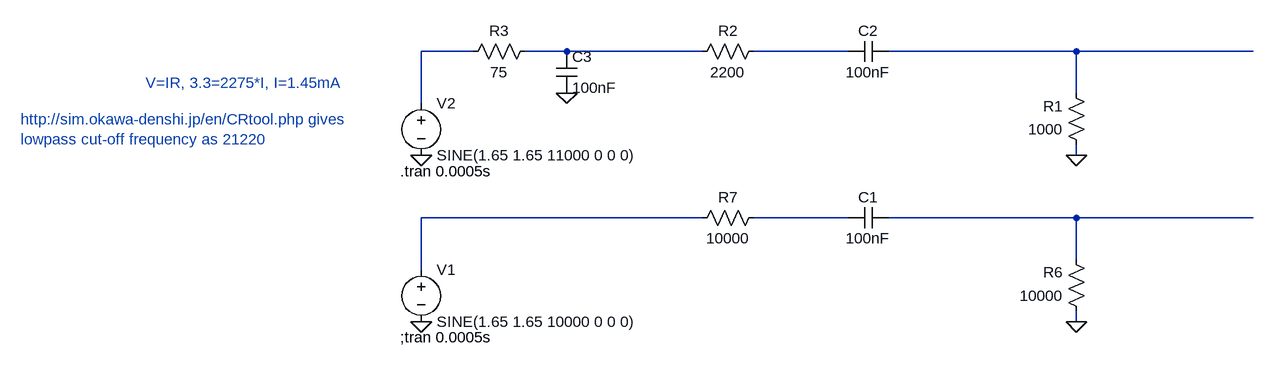
[diagram p0: schematic speaker_volume.asc]
speaker_volume.asc, the LTspice schematic file:
Version 4
SHEET 1 2328 724
WIRE 0 -192 -80 -192
WIRE 144 -192 80 -192
WIRE 352 -192 144 -192
WIRE 576 -192 432 -192
WIRE 928 -192 640 -192
WIRE 1200 -192 928 -192
WIRE 928 -128 928 -192
WIRE -80 -112 -80 -192
WIRE 928 -32 928 -48
WIRE 352 64 -80 64
WIRE 576 64 432 64
WIRE 928 64 640 64
WIRE 1200 64 928 64
WIRE 928 128 928 64
WIRE -80 144 -80 64
WIRE 928 224 928 208
FLAG -80 224 0
FLAG 928 224 0
FLAG -80 -32 0
FLAG 928 -32 0
FLAG 144 -128 0
SYMBOL voltage -80 128 R0
WINDOW 123 0 0 Left 2
WINDOW 39 0 0 Left 2
SYMATTR InstName V1
SYMATTR Value SINE(1.65 1.65 10000 0 0 0)
SYMBOL cap 640 48 R90
WINDOW 0 0 32 VBottom 2
WINDOW 3 32 32 VTop 2
SYMATTR InstName C1
SYMATTR Value 100nF
SYMBOL res 944 224 R180
WINDOW 0 36 76 Left 2
WINDOW 3 36 40 Left 2
SYMATTR InstName R6
SYMATTR Value 10000
SYMBOL res 448 48 R90
WINDOW 0 0 56 VBottom 2
WINDOW 3 32 56 VTop 2
SYMATTR InstName R7
SYMATTR Value 10000
SYMBOL voltage -80 -128 R0
WINDOW 123 0 0 Left 2
WINDOW 39 0 0 Left 2
SYMATTR InstName V2
SYMATTR Value SINE(1.65 1.65 11000 0 0 0)
SYMBOL cap 640 -208 R90
WINDOW 0 0 32 VBottom 2
WINDOW 3 32 32 VTop 2
SYMATTR InstName C2
SYMATTR Value 100nF
SYMBOL res 944 -32 R180
WINDOW 0 36 76 Left 2
WINDOW 3 36 40 Left 2
SYMATTR InstName R1
SYMATTR Value 1000
SYMBOL res 448 -208 R90
WINDOW 0 0 56 VBottom 2
WINDOW 3 32 56 VTop 2
SYMATTR InstName R2
SYMATTR Value 2200
SYMBOL cap 128 -192 R0
SYMATTR InstName C3
SYMATTR Value 100nF
SYMBOL res 96 -208 R90
WINDOW 0 0 56 VBottom 2
WINDOW 3 32 56 VTop 2
SYMATTR InstName R3
SYMATTR Value 75
TEXT -112 248 Left 2 !;tran 0.0005s
TEXT -112 -8 Left 2 !.tran 0.0005s
TEXT -504 -144 Left 2 ;V=IR, 3.3=2275*I, I=1.45mA
TEXT -696 -88 Left 2 ;http://sim.okawa-denshi.jp/en/CRtool.php gives\nlowpass cut-off frequency as 21220

The netlist it stands for:
* speaker_volume.asc
V1 N005 0 SINE(1.65 1.65 10000 0 0 0)
C1 N007 N006 100nF
R6 0 N007 10000
R7 N006 N005 10000
V2 N001 0 SINE(1.65 1.65 11000 0 0 0)
C2 N004 N003 100nF
R1 0 N004 1000
R2 N003 N002 2200
C3 N002 0 100nF
R3 N002 N001 75
;tran 0.0005s
.tran 0.0005s
* V=IR, 3.3=2275*I, I=1.45mA
* http://sim.okawa-denshi.jp/en/CRtool.php gives
* lowpass cut-off frequency as 21220
.backanno
.end